# EAGLE design Adafruit NeoPixel 8 Stick v2 (EAGLE 9.6.2)
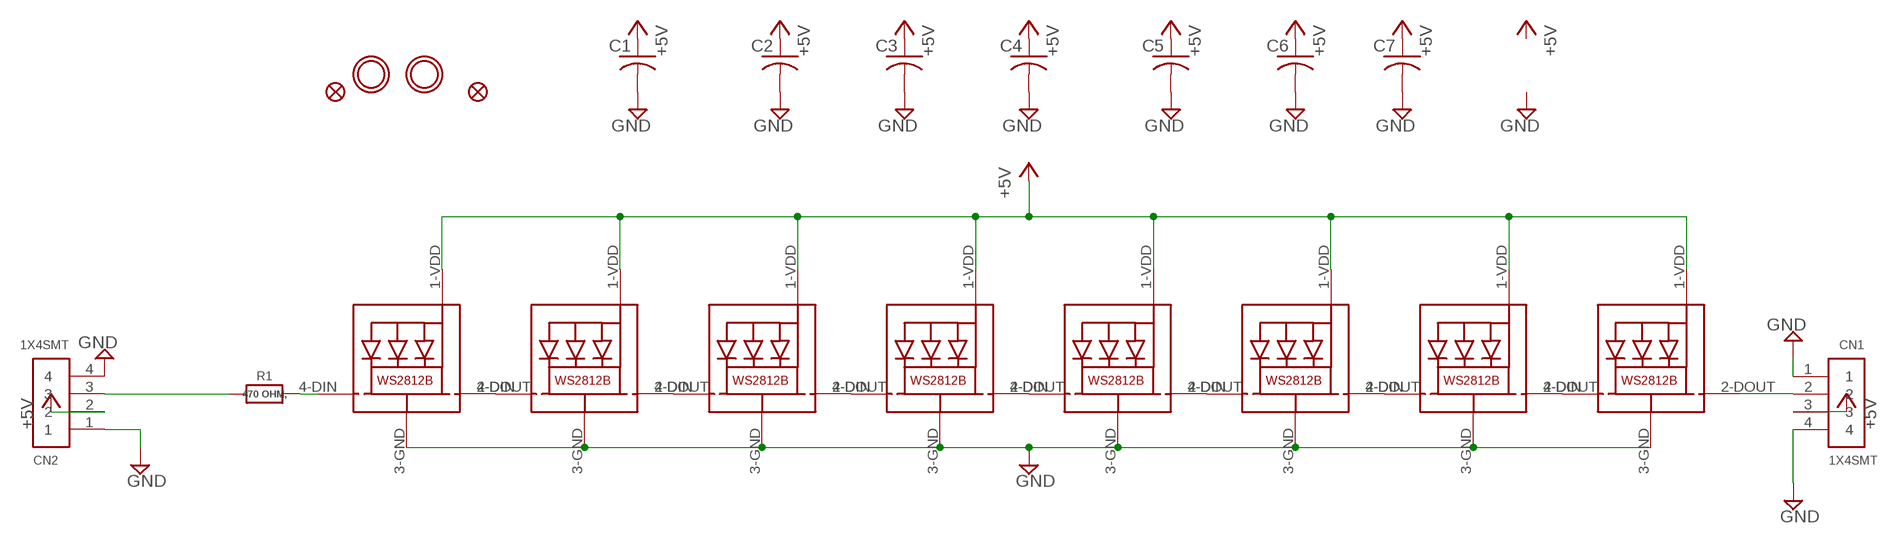
[diagram p0: schematic, sheet 1]

## Parts
C1  C-USC0805K  [C0805K]
C2  C-USC0805K  [C0805K]
C3  C-USC0805K  [C0805K]
C4  C-USC0805K  [C0805K]
C5  C-USC0805K  [C0805K]
C6  C-USC0805K  [C0805K]
C7  C-USC0805K  [C0805K]
CN1  1X4SMT  [1X4-SMT]
CN2  1X4SMT  [1X4-SMT]
FID1  FIDUCIAL""  [FIDUCIAL_1MM]
FID3  FIDUCIAL""  [FIDUCIAL_1MM]
LED1  WS2812B5050-NARROW  [WS2812B-NARROW]
LED2  WS2812B5050-NARROW  [WS2812B-NARROW]
LED3  WS2812B5050-NARROW  [WS2812B-NARROW]
LED4  WS2812B5050-NARROW  [WS2812B-NARROW]
LED5  WS2812B5050-NARROW  [WS2812B-NARROW]
LED6  WS2812B5050-NARROW  [WS2812B-NARROW]
LED7  WS2812B5050-NARROW  [WS2812B-NARROW]
LED8  WS2812B5050-NARROW  [WS2812B-NARROW]
R1  470 OHM,  RESISTOR_0805MP  [_0805MP]
U$2  MOUNTINGHOLE2.0  [MOUNTINGHOLE_2.0_PLATED]
U$3  MOUNTINGHOLE2.0  [MOUNTINGHOLE_2.0_PLATED]

## Nets
+5V: C1.1 C2.1 C3.1 C4.1 C5.1 C6.1 C7.1 CN1.3 CN2.2 LED1.1-VDD(VDD) LED2.1-VDD(VDD) LED3.1-VDD(VDD) LED4.1-VDD(VDD) LED5.1-VDD(VDD) LED6.1-VDD(VDD) LED7.1-VDD(VDD) LED8.1-VDD(VDD)
GND: C1.2 C2.2 C3.2 C4.2 C5.2 C6.2 C7.2 CN1.1 CN1.4 CN2.1 CN2.4 LED1.3-GND(GND) LED2.3-GND(GND) LED3.3-GND(GND) LED4.3-GND(GND) LED5.3-GND(GND) LED6.3-GND(GND) LED7.3-GND(GND) LED8.3-GND(GND)
N$1: LED1.2-DOUT(DO) LED2.4-DIN(DI)
N$2: LED2.2-DOUT(DO) LED3.4-DIN(DI)
N$3: LED3.2-DOUT(DO) LED4.4-DIN(DI)
N$4: LED4.2-DOUT(DO) LED5.4-DIN(DI)
N$5: LED5.2-DOUT(DO) LED6.4-DIN(DI)
N$6: LED6.2-DOUT(DO) LED7.4-DIN(DI)
N$7: LED7.2-DOUT(DO) LED8.4-DIN(DI)
N$8: CN2.3 R1.1
N$9: CN1.2 LED8.2-DOUT(DO)
N$10: LED1.4-DIN(DI) R1.2

## Library data of the parts
C1-C7 = rcl:C-US: CAPACITOR, American symbol
CN1 CN2 = adafruit:1X4: 4-pin connector
FID1 FID3 = microbuilder:FIDUCIAL: Fiducial Alignment Points Various fiducial points for machine vision alignment.; BOM: EXCLUDE
LED1-LED8 = microbuilder:WS2812B5050
R1 = microbuilder:RESISTOR: Resistors For new designs, use the packages preceded by an '_' character since they are more reliable: The following footprints should be used on most boards: _0402 - Standard footprint for regular board layouts _0603 - Standard footprint for regular board layouts _0805 - Standard footprint for regular board layouts _1206 - Standard footprint for regular board layouts For extremely tight-pitch boards where space is at a premium, the following 'micro-pitch' footprints can be used (smaller pads, no silkscreen outline, etc.): _0402MP - Micro-pitch footprint for very dense/compact boards _0603MP - Micro-pitch footprint for very dense/compact boards _0805MP - Micro-pitch footprint for very dense/compact boards _1206MP - Micro-pitch footprint for very dense/compact boards
U$2 U$3 = microbuilder:MOUNTINGHOLE: Mounting Hole For #2 screws (0.086"/2.18mm width, 0.094"/2.4mm hole) use 2.5mm

## Board
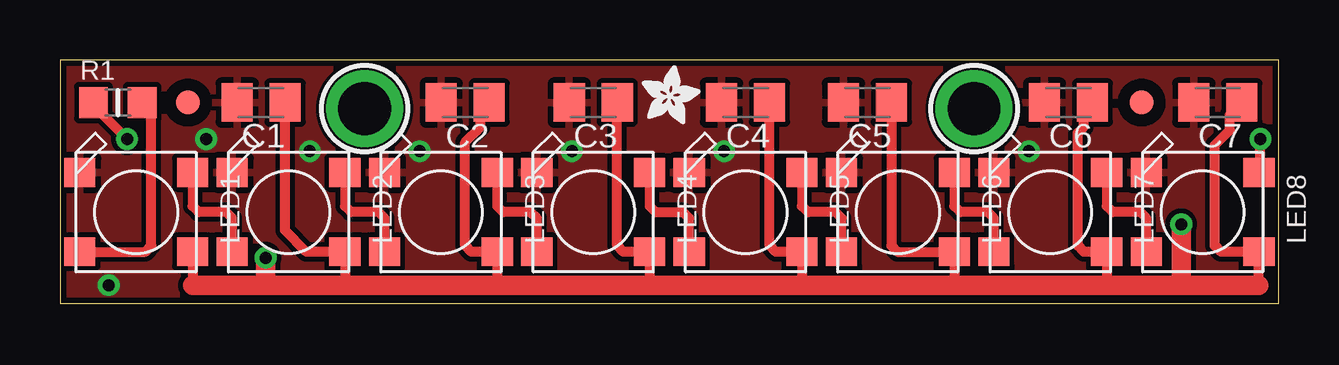
[diagram p1: board, top side]
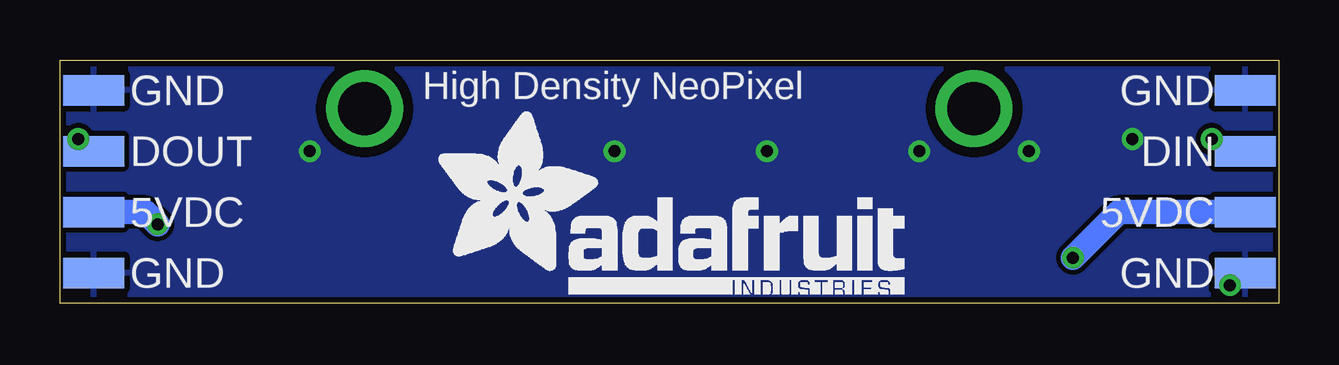
[diagram p2: board, bottom side, seen from below]

Size 50.8 x 10.16 mm. Coordinates in mm from the lower left corner, seen from the top.
Outline: 0,10.16 0,0 50.8,0 50.8,10.16 0,10.16
Copper layers (1*16): Top 0.035mm / dielectric 1.5mm / Bottom 0.035mm
Design rules "adafruit *": minimum track width 8mil, minimum drill 15.5mil, track to track 8mil, track to pad 8mil, pad to pad 8mil, via to via 8mil, smd to smd 8mil, copper to edge 10mil, drill to drill 8mil, minimum pad ring 10mil, minimum via ring 8mil, stop-mask expansion 4mil, vias tented up to drill 20mil, thermal gap 10mil

### Footprints (pad centres in the part's own frame; a part is rotated, then mirrored left to right if it is on the bottom)
C0805K = smd 1.3 x 1.6: 1 -1,0; 2 1,0
1X4-SMT = smd 1.27 x 2.54: 1 -3.81,0; 2 -1.27,0; 3 1.27,0; 4 3.81,0
FIDUCIAL_1MM = smd 1 x 1: 1 0,0
WS2812B-NARROW = smd 1.3 x 1.2: 1-VDD 2.35,-1.65; 2-DOUT 2.35,1.65; 3-GND -2.35,1.65; 4-DIN -2.35,-1.65
_0805MP = smd 1.2 x 1.3: 1 -1.016,0; 2 1.016,0
MOUNTINGHOLE_2.0_PLATED = drill 2.2 pad 3: P$1 0,0

### Placement (x,y rotation side)
C1  8.38,8.38 180 top
C2  16.89,8.38 180 top
C3  22.23,8.38 180 top
C4  28.57,8.38 180 top
C5  33.66,8.38 180 top
C6  42.04,8.38 180 top
C7  48.26,8.38 180 top
CN1  49.4,5.08 270 bottom
CN2  1.4,5.08 90 bottom
FID1  5.33,8.38 0 top
FID3  45.09,8.38 0 top
LED1  3.17,3.81 0 top
LED2  9.53,3.81 0 top
LED3  15.88,3.81 0 top
LED4  22.23,3.81 0 top
LED5  28.57,3.81 0 top
LED6  34.92,3.81 0 top
LED7  41.27,3.81 0 top
LED8  47.62,3.81 0 top
R1  2.41,8.38 0 top
U$1  [ADAFRUIT_TEXT_20MM]  35.18,0.38 0 bottom
U$2  12.7,8.13 0 top
U$3  38.1,8.13 0 top
U$4  [ADAFRUIT_2.5MM]  24.26,7.49 0 top

### Tracks (layer width: path | path; a pad name or v marks a point on that pad's centre or on a via)
+5V  (via drill 0.5)
  Top 0.406: C1.1 9.38,3.05 10.27,2.16 LED2.1-VDD 11.88,0.76 13.21,0.76 | C3.1 23.23,2.41 23.48,2.16 LED4.1-VDD 24.57,0.76 24.64,0.76 | C4.1 29.57,2.41 29.83,2.16 LED5.1-VDD 30.93,0.76 31.24,0.76 | LED1.1-VDD 5.53,0.76 | 49.98,0.76 LED8.1-VDD 48.39,2.16 48.13,2.41 48.13,6.6 48.77,7.24 48.77,7.89 C7.1 | 18.54,0.76 18.23,0.76 LED3.1-VDD 17.14,2.16 16.89,2.41 16.89,6.73 17.53,7.37 17.53,8.02 C2.1 | 43.94,0.76 43.62,0.76 LED7.1-VDD 42.67,2.16 42.42,2.41 42.42,7.11 42.67,7.37 42.67,8.02 C6.1 | 37.85,0.76 37.27,0.76 LED6.1-VDD 34.91,2.16 34.66,2.41 C5.1
  Top 0.813: 5.53,0.76 8.57,0.76 | 8.57,0.76 13.21,0.76 18.54,0.76 24.64,0.76 31.24,0.76 37.85,0.76 43.94,0.76 46.74,0.76 | 46.74,0.76 49.98,0.76 | v46.74,3.3 46.74,0.76 | v8.57,1.91 8.57,0.76
  Bottom 1.016: CN2.2 6.67,3.81 v8.57,1.91 | v46.74,3.3 47.24,3.81 CN1.3
GND  (via drill 0.5)
  other vias: 6.1,6.86 2.03,0.76 10.41,6.35 14.99,6.35 21.34,6.35 27.69,6.35 40.39,6.35
  pour Top: 0,10.16 0,0 50.93,0 50.93,10.16
  pour Bottom: -0.13,10.29 -0.13,0 50.93,0 50.93,10.29
N$1
  Top 0.406: LED1.2-DOUT 5.53,4.06 5.78,3.81 6.92,3.81 7.17,3.56 LED2.4-DIN
N$2
  Top 0.406: LED2.2-DOUT 11.88,4.06 12.13,3.81 13.27,3.81 13.53,3.56 LED3.4-DIN
N$3
  Top 0.406: LED3.2-DOUT 18.23,4.06 18.48,3.81 19.62,3.81 19.88,3.56 LED4.4-DIN
N$4
  Top 0.406: LED4.2-DOUT 24.57,4.06 24.83,3.81 25.97,3.81 26.23,3.56 LED5.4-DIN
N$5
  Top 0.406: LED5.2-DOUT 30.93,4.06 31.18,3.81 32.32,3.81 32.58,3.56 LED6.4-DIN
N$6
  Top 0.406: LED6.2-DOUT 37.27,4.06 37.53,3.81 38.67,3.81 38.92,3.56 LED7.4-DIN
N$7
  Top 0.406: LED7.2-DOUT 43.62,4.06 43.88,3.81 45.02,3.81 45.27,3.56 LED8.4-DIN
N$8  (via drill 0.5)
  Top 0.406: R1.1 1.4,8.26 v2.79,6.86
  Bottom 0.406: CN2.3 2.29,6.35 v2.79,6.86
N$9  (via drill 0.5)
  Top 0.406: LED8.2-DOUT 50.04,5.52 v50.04,6.86
  Bottom 0.406: v50.04,6.86 49.53,6.35 CN1.2
N$10
  Top 0.406: LED1.4-DIN 3.56,2.16 3.81,2.41 3.81,8 R1.2

### Text on the board
bPlace: GND | High Density NeoPixel | GND | DIN | DOUT | 5VDC | 5VDC | GND | GND